# Altium schematic sheet Power_Monitor.SchDoc: Battery and Charger Breakouts
size A; Date: Dec 27, 2017; DrawnBy: Seyed Omid Hasanli; Revision: 1.0; SheetNumber: 12
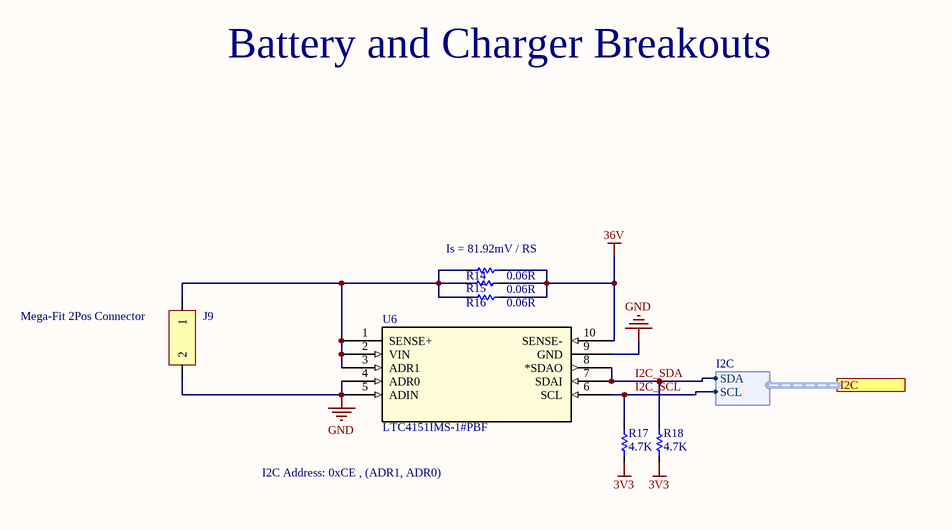
[diagram p0: Power_Monitor.SchDoc]

## Parts
J9  Mega-Fit 2Pos Connector  [MegaFit-2Pos]
R14  value 0.06R  [RES_0603]  (hidden comment: Res)
R15  value 0.06R  [RES_0603]  (hidden comment: Res)
R16  value 0.06R  [RES_0603]  (hidden comment: Res)
R17  value 4.7K  [RES_0603]  (hidden comment: Res)
R18  value 4.7K  [RES_0603]  (hidden comment: Res)
U6  LTC4151IMS-1#PBF  [MSOP-10_MS]

## Ports
I2C (harness I2C)

## Harnesses
I2C: SCL, SDA

## Nets
3V3: R17.1 R18.1
36V: R14.2 R15.2 R16.2 U6.10(SENSE-)
GND: J9.2 U6.4(ADR0) U6.5(ADIN) U6.9(GND)
I2C_SCL: R17.2 U6.6(SCL) ; port I2C.SCL
I2C_SDA: R18.2 U6.7(SDAI) U6.8(*SDAO) ; port I2C.SDA
NetJ9_1: J9.1 R14.1 R15.1 R16.1 U6.1(SENSE+) U6.2(VIN) U6.3(ADR1)

## Notes on the sheet
- Battery and Charger Breakouts
- (near R14) Is = 81.92mV / RS
- I2C Address: 0xCE , (ADR1, ADR0)
- Title:
- DrawnBy:
- Revision:
- SheetNumber:
- Date:
- Datasheet Link:

## Library data of the parts
J9 = Mega-Fit 2Pos: Molex MegaFit 2-Pos Connector; URL: https://www.digikey.com/product-detail/en/molex-llc/0768290010/WM11979-ND/5639621; DigiKey PN: WM11979-ND
U6 = LTC4151IMS-1#PBF: Imported; Vendor: Linear Technology; C: Copyright (C) 2016 Accelerated Designs. All rights reserved; Manufacturer_Part_Number: ltc4151ims-1#pbf; Copyright: Copyright (C) 2016 Accelerated Designs. All rights reserved; Value: Value; Type: Type; RefDes: RefDes